# EAGLE design CM_Nightfall-Air_v1 (EAGLE 9.6.2)
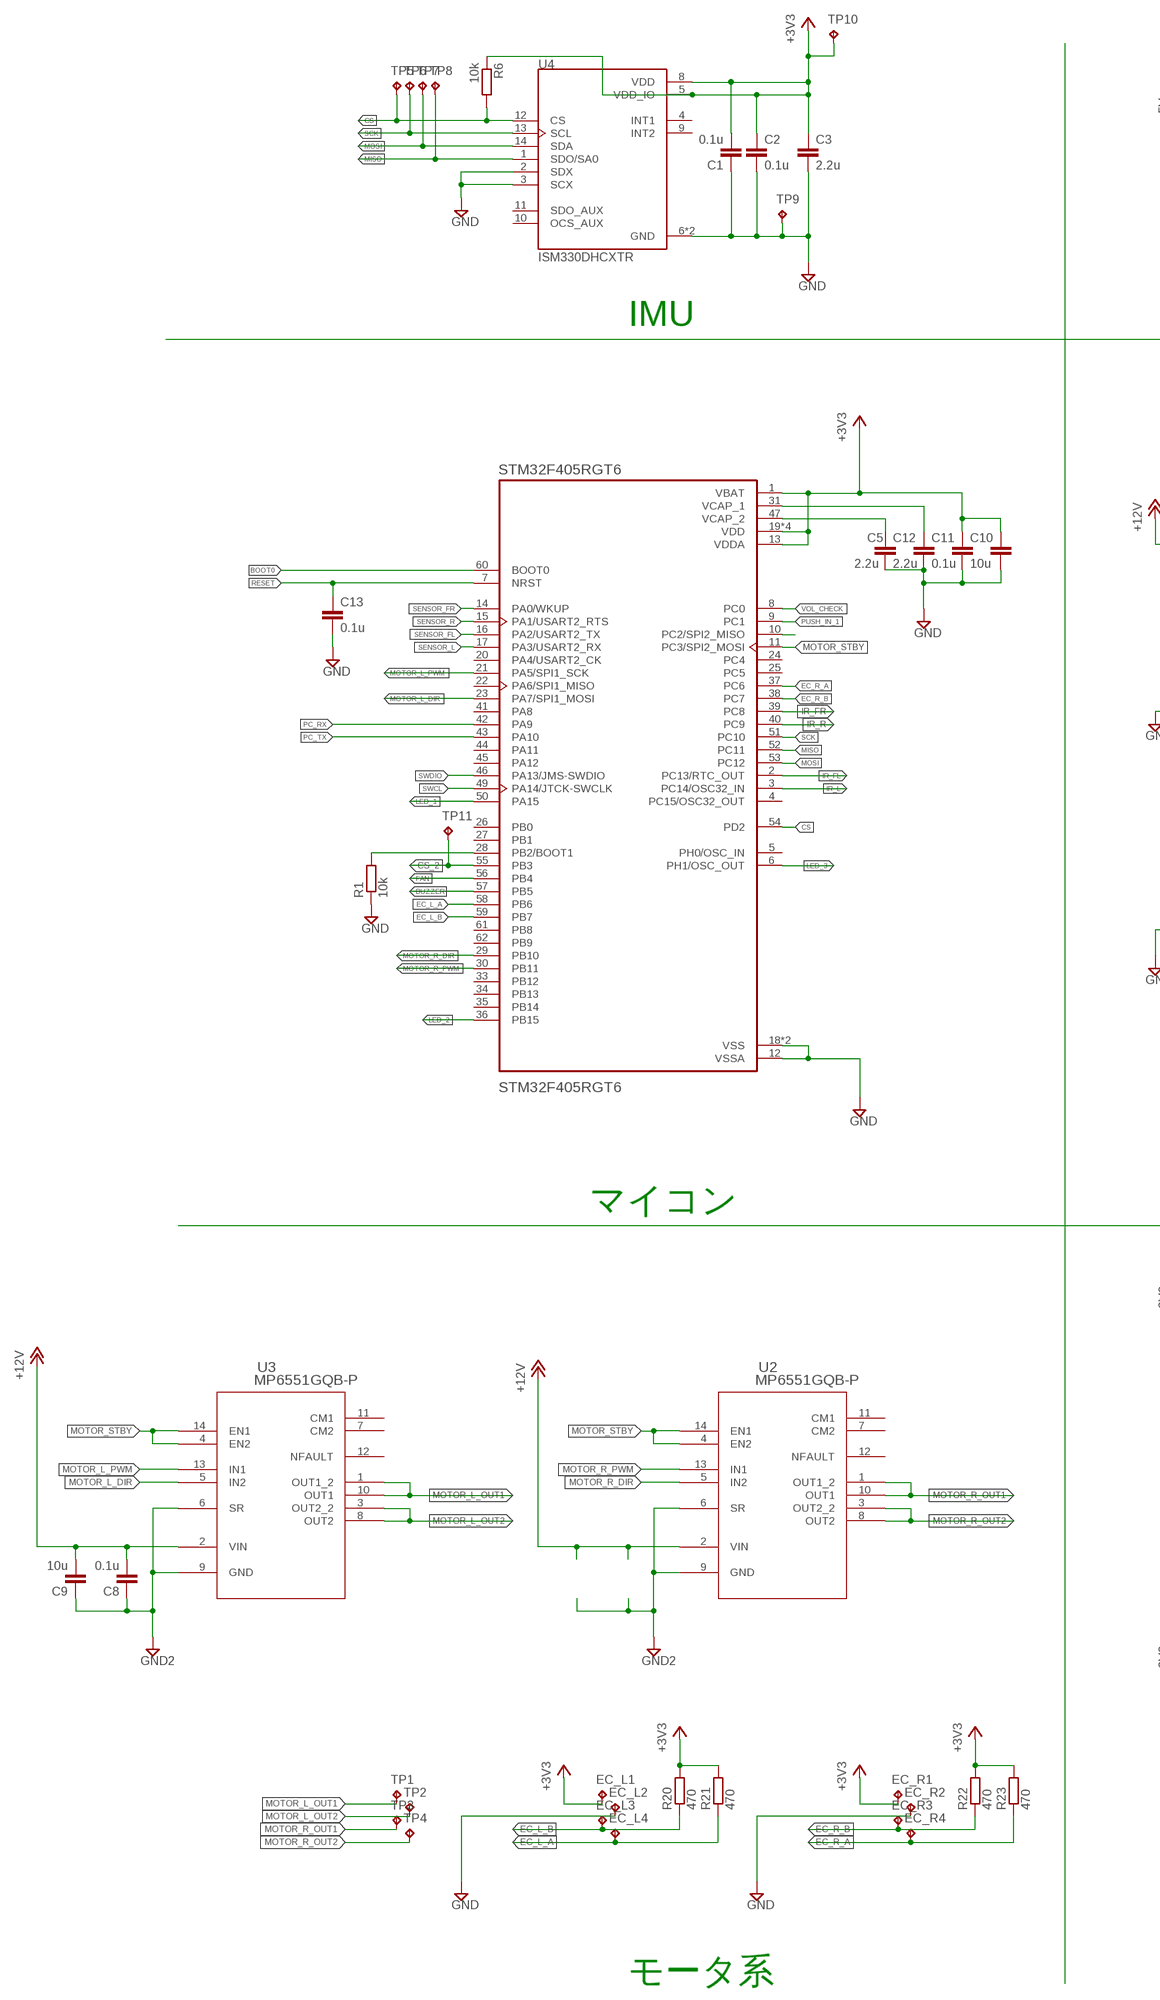
[diagram p0: schematic, sheet 1, part 1 of 2]
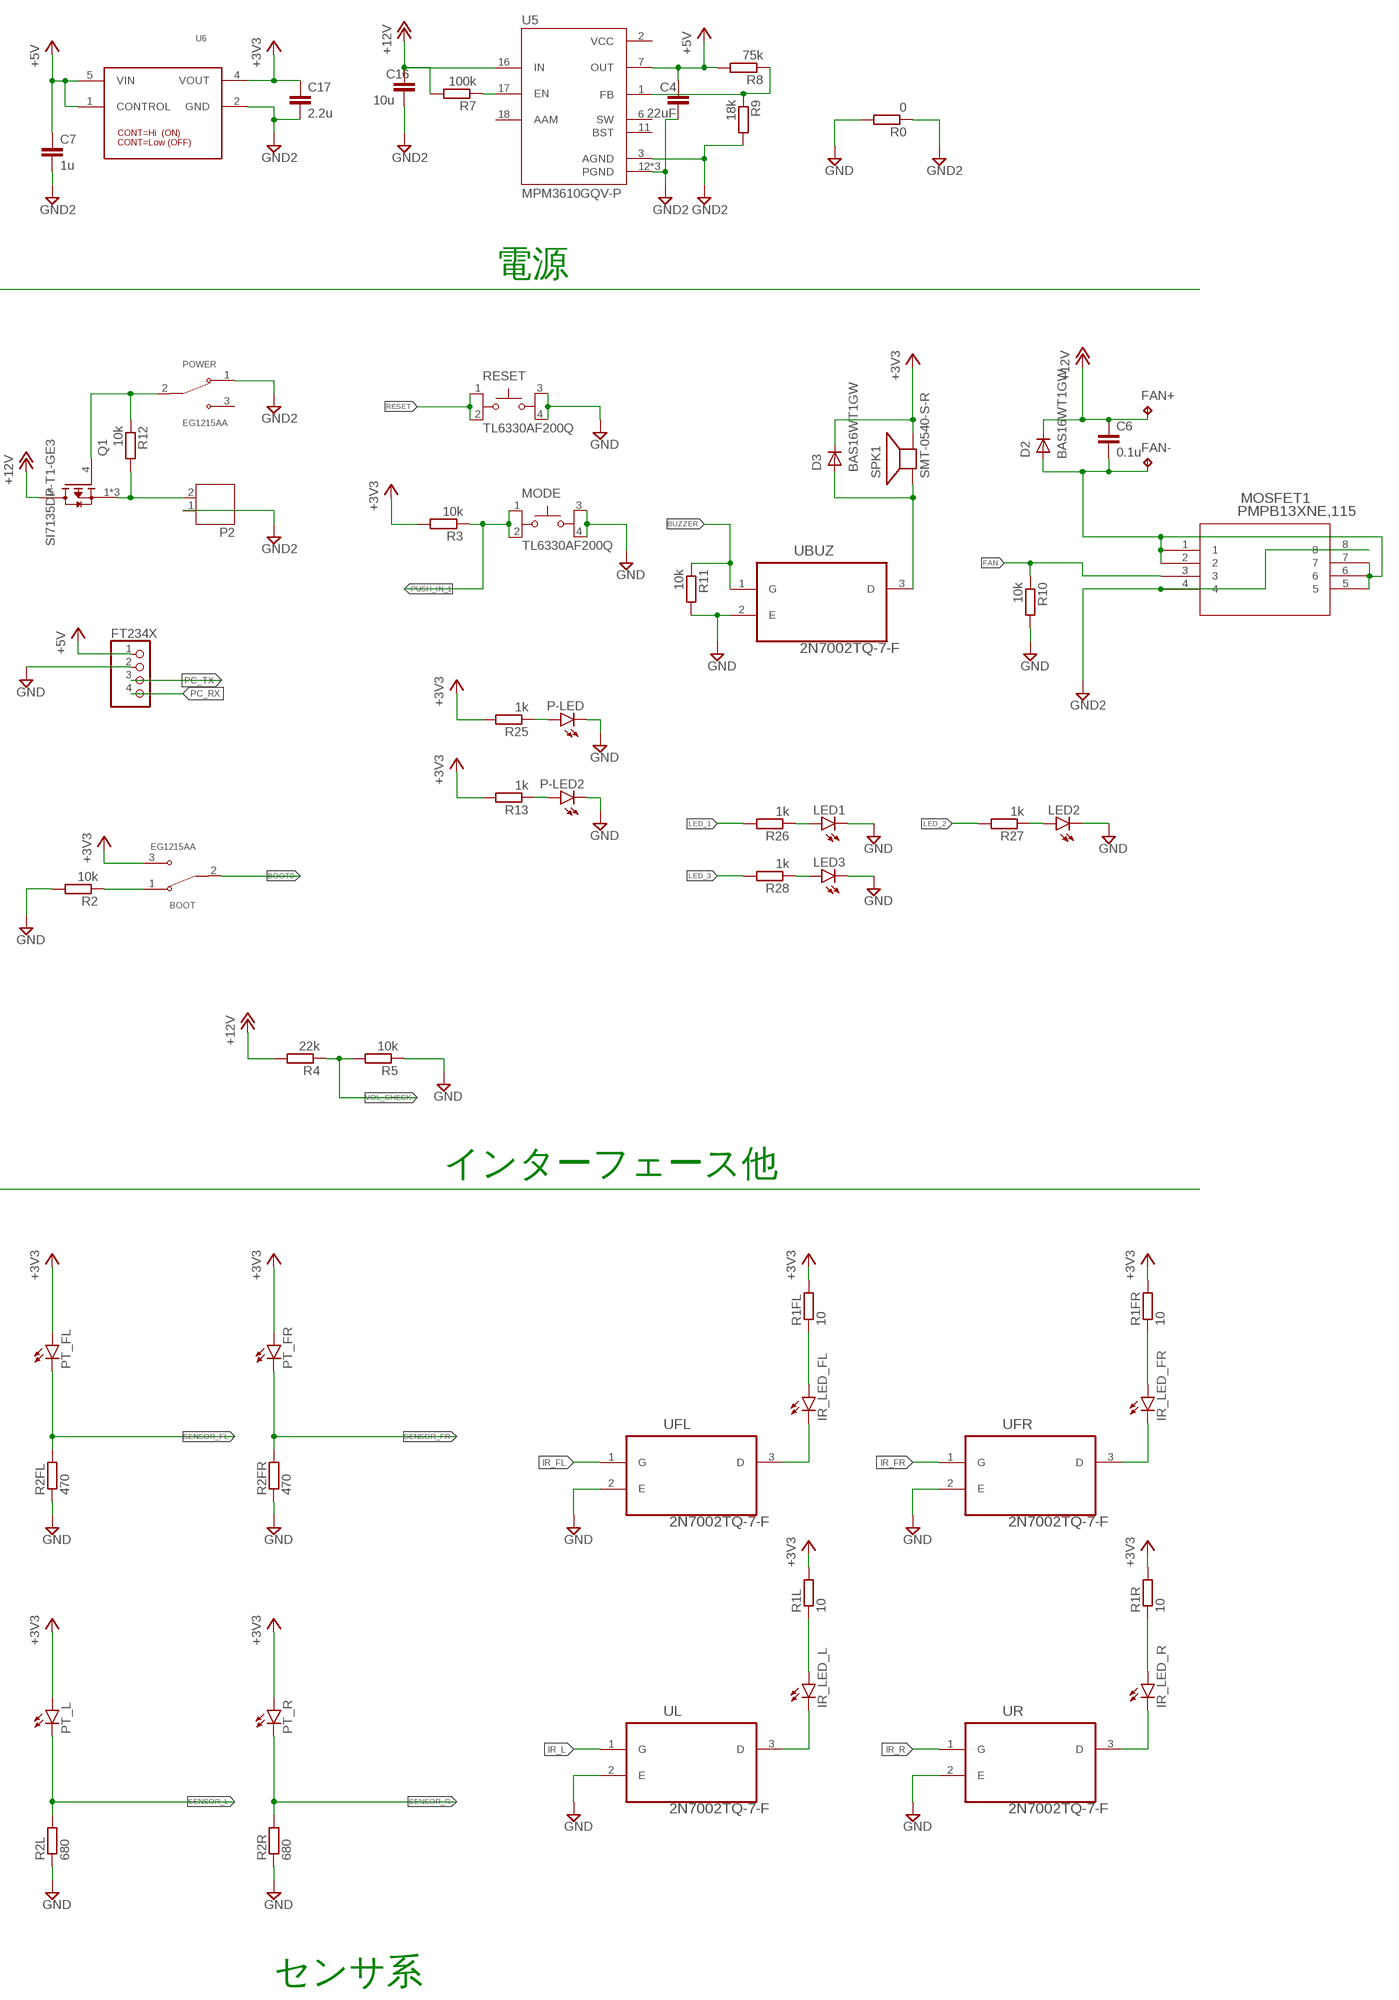
[diagram p1: schematic, sheet 1, part 2 of 2]

## Parts
BOOT  EG1215AA  [SW_EG1215AA]
C1  0.1u  C-EUC0402  [C0402]
C2  0.1u  C-EUC0402  [C0402]
C3  2.2u  C-EUC0402  [C0402]
C4  22uF  C-EUC0402  [C0402]
C5  2.2u  C-EUC0402  [C0402]
C6  0.1u  C-EUC0402  [C0402]
C7  1u  C-EUC0402  [C0402]
C8  0.1u  C-EUC0402  [C0402]
C9  10u  C-EUC0402  [C0402]
C10  10u  C-EUC0402  [C0402]
C11  0.1u  C-EUC0402  [C0402]
C12  2.2u  C-EUC0402  [C0402]
C13  0.1u  C-EUC0402  [C0402]
C16  10u  C-EUC0402  [C0402]
C17  2.2u  C-EUC0402  [C0402]
D2  BAS16WT1GW  [SOT323]
D3  BAS16WT1GW  [SOT323]
EC_L1  TPB1,27  [B1,27]
EC_L2  TPB1,27  [B1,27]
EC_L3  TPB1,27  [B1,27]
EC_L4  TPB1,27  [B1,27]
EC_R1  TPB1,27  [B1,27]
EC_R2  TPB1,27  [B1,27]
EC_R3  TPB1,27  [B1,27]
EC_R4  TPB1,27  [B1,27]
FAN+  TPB1,27  [B1,27]
FAN-  TPB1,27  [B1,27]
FT234X  PINHD-1X4  [1X04]
IR_LED_FL  LED5MM  [LED5MM]
IR_LED_FR  LED5MM  [LED5MM]
IR_LED_L  LED5MM  [LED5MM]
IR_LED_R  LED5MM  [LED5MM]
LED1  LEDCHIPLED_0603  [CHIPLED_0603]
LED2  LEDCHIPLED_0603  [CHIPLED_0603]
LED3  LEDCHIPLED_0603  [CHIPLED_0603]
MODE  TL6330AF200Q  [SW_TL6330AF200Q]
MOSFET1  PMPB13XNE,115  [DFN2020MD-6_SOT1220_NEX]
P2  JST-PH2  [JST-PH2]
P-LED  LEDCHIPLED_0603  [CHIPLED_0603]
P-LED2  LEDCHIPLED_0603  [CHIPLED_0603]
POWER  EG1215AA  [SW_EG1215AA]
PT_FL  LED5MM  [LED5MM]
PT_FR  LED5MM  [LED5MM]
PT_L  LED5MM  [LED5MM]
PT_R  LED5MM  [LED5MM]
Q1  SI7135DP-T1-GE3  [TRANS_SI7135DP-T1-GE3]
R0  0  R-EU_R0402  [R0402]
R1  10k  R-EU_R0402  [R0402]
R1FL  10  R-EU_R0402  [R0402]
R1FR  10  R-EU_R0402  [R0402]
R1L  10  R-EU_R0402  [R0402]
R1R  10  R-EU_R0402  [R0402]
R2  10k  R-EU_R0402  [R0402]
R2FL  470  R-EU_R0402  [R0402]
R2FR  470  R-EU_R0402  [R0402]
R2L  680  R-EU_R0402  [R0402]
R2R  680  R-EU_R0402  [R0402]
R3  10k  R-EU_R0402  [R0402]
R4  22k  R-EU_R0402  [R0402]
R5  10k  R-EU_R0402  [R0402]
R6  10k  R-EU_R0402  [R0402]
R7  100k  R-EU_R0402  [R0402]
R8  75k  R-EU_R0402  [R0402]
R9  18k  R-EU_R0402  [R0402]
R10  10k  R-EU_R0402  [R0402]
R11  10k  R-EU_R0402  [R0402]
R12  10k  R-EU_R0402  [R0402]
R13  1k  R-EU_R0402  [R0402]
R20  470  R-EU_R0402  [R0402]
R21  470  R-EU_R0402  [R0402]
R22  470  R-EU_R0402  [R0402]
R23  470  R-EU_R0402  [R0402]
R25  1k  R-EU_R0402  [R0402]
R26  1k  R-EU_R0402  [R0402]
R27  1k  R-EU_R0402  [R0402]
R28  1k  R-EU_R0402  [R0402]
RESET  TL6330AF200Q  [SW_TL6330AF200Q]
SPK1  SMT-0540-S-R  [SMT-0540-S-R]
STM32F405RGT6  STM32F405RGT6  [QFP50P1200X1200X160-64N]
TP1  TPB1,27  [B1,27]
TP2  TPB1,27  [B1,27]
TP3  TPB1,27  [B1,27]
TP4  TPB1,27  [B1,27]
TP5  TPTP06R  [TP06R]
TP6  TPTP06R  [TP06R]
TP7  TPTP06R  [TP06R]
TP8  TPTP06R  [TP06R]
TP9  TPTP06R  [TP06R]
TP10  TPTP06R  [TP06R]
TP11  TPTP06R  [TP06R]
U2  MP6551GQB-P  [QFN-14_MP6551_MNP]
U3  MP6551GQB-P  [QFN-14_MP6551_MNP]
U4  ISM330DHCXTR  [PQFN50P250X300X86-14N]
U5  MPM3610GQV-P  [CONV_MPM3610GQV-P]
U6  I-10673_NJM2884U1-33  [NJM2884U1-33]
UBUZ  2N7002TQ-7-F  [SOT50P160X90-3N]
UFL  2N7002TQ-7-F  [SOT50P160X90-3N]
UFR  2N7002TQ-7-F  [SOT50P160X90-3N]
UL  2N7002TQ-7-F  [SOT50P160X90-3N]
UR  2N7002TQ-7-F  [SOT50P160X90-3N]

## Nets
+3V3 [power]: BOOT.3 C1.2 C2.1 C3.1 C10.1 C11.1 C17.1 D3.3(K) EC_L1.TP EC_R1.TP PT_FL.A PT_FR.A PT_L.A PT_R.A R1FL.2 R1FR.2 R1L.2 R1R.2 R3.2 R6.1 R13.2 R20.2 R21.2 R22.2 R23.2 R25.2 SPK1.+(-) STM32F405RGT6.1(VBAT) STM32F405RGT6.13(VDDA) STM32F405RGT6.19(VDD) STM32F405RGT6.32(VDD) STM32F405RGT6.48(VDD) STM32F405RGT6.64(VDD) TP10.TP U4.5(VDD_IO) U4.8(VDD) U6.4(VOUT)
+5V [power]: C4.1 C7.1 FT234X.1 R8.2 U5.7(OUT) U6.1(CONTROL) U6.5(VIN)
+12V: C6.1 C8.2 C9.2 C16.1 D2.3(K) FAN+.TP Q1.5(D) R4.2 R7.2 U2.2(VIN) U3.2(VIN) U5.16(IN)
BOOT0: BOOT.2 STM32F405RGT6.60(BOOT0)
BUZZER: R11.1 STM32F405RGT6.57(PB5) UBUZ.1(G)
CS: R6.2 STM32F405RGT6.54(PD2) TP5.TP U4.12(CS)
CS_2: STM32F405RGT6.55(PB3) TP11.TP
EC_L_A: EC_L4.TP R21.1 STM32F405RGT6.58(PB6)
EC_L_B: EC_L3.TP R20.1 STM32F405RGT6.59(PB7)
EC_R_A: EC_R4.TP R23.1 STM32F405RGT6.37(PC6)
EC_R_B: EC_R3.TP R22.1 STM32F405RGT6.38(PC7)
FAN: MOSFET1.3 R10.1 STM32F405RGT6.56(PB4)
GND [motor]: C1.1 C2.2 C3.2 C5.2 C10.2 C11.2 C12.2 C13.2 EC_L2.TP EC_R2.TP FT234X.2 LED1.C LED2.C LED3.C MODE.3 MODE.4 P-LED2.C P-LED.C R0.2 R1.1 R2.2 R2FL.1 R2FR.1 R2L.1 R2R.1 R5.1 R10.2 R11.2 RESET.3 RESET.4 STM32F405RGT6.12(VSSA) STM32F405RGT6.18(VSS) STM32F405RGT6.63(VSS) TP9.TP U4.2(SDX) U4.3(SCX) U4.6(GND) U4.7(GND) UBUZ.2(E) UFL.2(E) UFR.2(E) UL.2(E) UR.2(E)
GND2 [motor]: C4.2 C7.2 C8.1 C9.1 C16.2 C17.2 MOSFET1.4 MOSFET1.8 P2.1 POWER.1 R0.1 R9.2 U2.6(SR) U2.9(GND) U3.6(SR) U3.9(GND) U5.3(AGND) U5.12(PGND) U5.13(PGND) U5.14(PGND) U6.2(GND)
IR_FL: STM32F405RGT6.2(PC13/RTC_OUT) UFL.1(G)
IR_FR: STM32F405RGT6.39(PC8) UFR.1(G)
IR_L: STM32F405RGT6.3(PC14/OSC32_IN) UL.1(G)
IR_R: STM32F405RGT6.40(PC9) UR.1(G)
LED_1: R26.2 STM32F405RGT6.50(PA15)
LED_2: R27.2 STM32F405RGT6.36(PB15)
LED_3: R28.2 STM32F405RGT6.6(PH1/OSC_OUT)
MISO: STM32F405RGT6.52(PC11) TP8.TP U4.1(SDO/SA0)
MOSI: STM32F405RGT6.53(PC12) TP7.TP U4.14(SDA)
MOTOR_L_DIR: STM32F405RGT6.23(PA7/SPI1_MOSI) U3.5(IN2)
MOTOR_L_OUT1 [motor]: TP1.TP U3.1(OUT1_2) U3.10(OUT1)
MOTOR_L_OUT2 [motor]: TP2.TP U3.3(OUT2_2) U3.8(OUT2)
MOTOR_L_PWM: STM32F405RGT6.21(PA5/SPI1_SCK) U3.13(IN1)
MOTOR_R_DIR: STM32F405RGT6.29(PB10) U2.5(IN2)
MOTOR_R_OUT1 [motor]: TP3.TP U2.1(OUT1_2) U2.10(OUT1)
MOTOR_R_OUT2 [motor]: TP4.TP U2.3(OUT2_2) U2.8(OUT2)
MOTOR_R_PWM: STM32F405RGT6.30(PB11) U2.13(IN1)
MOTOR_STBY: STM32F405RGT6.11(PC3/SPI2_MOSI) U2.4(EN2) U2.14(EN1) U3.4(EN2) U3.14(EN1)
N$1: P2.2 Q1.1(S) Q1.2(S) Q1.3(S) R12.2
N$2: IR_LED_FL.K(C) UFL.3(D)
N$4: R7.1 U5.17(EN)
N$5: P-LED2.A R13.1
N$7: R8.1 R9.1 U5.1(FB)
N$8: IR_LED_FL.A R1FL.1
N$10: IR_LED_L.K(C) UL.3(D)
N$11: POWER.2 Q1.4(G) R12.1
N$13: C5.1 STM32F405RGT6.47(VCAP_2)
N$14: C12.1 STM32F405RGT6.31(VCAP_1)
N$15 [motor]: R1.2 STM32F405RGT6.28(PB2/BOOT1)
N$16: IR_LED_L.A R1L.1
N$18: IR_LED_FR.K(C) UFR.3(D)
N$19: BOOT.1 R2.1
N$20: C6.2 D2.1(A) FAN-.TP MOSFET1.1 MOSFET1.2 MOSFET1.5 MOSFET1.6 MOSFET1.7
N$21: P-LED.A R25.1
N$23: D3.1(A) SPK1.-(+) UBUZ.3(D)
N$27: LED1.A R26.1
N$28: IR_LED_FR.A R1FR.1
N$29: IR_LED_R.K(C) UR.3(D)
N$30: IR_LED_R.A R1R.1
N$36: LED2.A R27.1
N$41: LED3.A R28.1
PC_RX: FT234X.4 STM32F405RGT6.42(PA9)
PC_TX: FT234X.3 STM32F405RGT6.43(PA10)
PUSH_IN_1: MODE.1 MODE.2 R3.1 STM32F405RGT6.9(PC1)
PUSH_IN_2: STM32F405RGT6.10(PC2/SPI2_MISO)
RESET: C13.1 RESET.1 RESET.2 STM32F405RGT6.7(NRST)
SCK: STM32F405RGT6.51(PC10) TP6.TP U4.13(SCL)
SENSOR_FL: PT_FL.K(C) R2FL.2 STM32F405RGT6.16(PA2/USART2_TX)
SENSOR_FR: PT_FR.K(C) R2FR.2 STM32F405RGT6.14(PA0/WKUP)
SENSOR_L: PT_L.K(C) R2L.2 STM32F405RGT6.17(PA3/USART2_RX)
SENSOR_R: PT_R.K(C) R2R.2 STM32F405RGT6.15(PA1/USART2_RTS)
SWCL: STM32F405RGT6.49(PA14/JTCK-SWCLK)
SWDIO: STM32F405RGT6.46(PA13/JMS-SWDIO)
VOL_CHECK: R4.1 R5.2 STM32F405RGT6.8(PC0)
Unconnected: POWER.3 STM32F405RGT6.4(PC15/OSC32_OUT) STM32F405RGT6.5(PH0/OSC_IN) STM32F405RGT6.20(PA4/USART2_CK) STM32F405RGT6.22(PA6/SPI1_MISO) STM32F405RGT6.24(PC4) STM32F405RGT6.25(PC5) STM32F405RGT6.26(PB0) STM32F405RGT6.27(PB1) STM32F405RGT6.33(PB12) STM32F405RGT6.34(PB13) STM32F405RGT6.35(PB14) STM32F405RGT6.41(PA8) STM32F405RGT6.44(PA11) STM32F405RGT6.45(PA12) STM32F405RGT6.61(PB8) STM32F405RGT6.62(PB9) U2.7(CM2) U2.11(CM1) U2.12(NFAULT) U3.7(CM2) U3.11(CM1) U3.12(NFAULT) U4.4(INT1) U4.9(INT2) U4.10(OCS_AUX) U4.11(SDO_AUX) U5.6(SW) U5.11(BST) U5.18(AAM)

## Notes on the sheet
- IMU | 電源
- マイコン | インターフェース他
- モータ系
- センサ系

## Power pins joined to a net without a drawn wire
VCC: U5.2(VCC)

## Library data of the parts
BOOT POWER = EG1215AA:EG1215AA: Slide Switch SPDT Surface Mount, Right Angle Check availability <https://pricing.snapeda.com/parts/EG1215AA/E-Switch/view-part?ref=eda>; AVAILABILITY: In Stock; CHECK_PRICES: https://www.snapeda.com/parts/EG1215AA/E-Switch/view-part/?ref=eda; DESCRIPTION: Slide Switch SPDT Surface Mount, Right Angle; MF: E-Switch; MP: EG1215AA; PACKAGE: None; PRICE: None; PURCHASE-URL: https://www.snapeda.com/api/url_track_click_mouser/?unipart_id=3210616&manufacturer=E-Switch&part_name=EG1215AA&search_term=eg1215aa; SNAPEDA_LINK: https://www.snapeda.com/parts/EG1215AA/E-Switch/view-part/?ref=snap
C1-C13 C16 C17 = rcl:C-EU: CAPACITOR, European symbol; SPICEPREFIX: C
D2 D3 = BAS16WT1G:BAS16WT1G: Check availability <https://pricing.snapeda.com/parts/BAS16WT1G/ON%20Semiconductor/view-part?ref=eda>; AVAILABILITY: In Stock; CHECK_PRICES: https://www.snapeda.com/parts/BAS16WT1G/Onsemi/view-part/?ref=eda; DESCRIPTION: DIODE, SIGNAL, 75V, SC70; Diode Type:Small Signal; Voltage, Vrrm:75V; Time, trr Typ:6ns; Voltage, Vf Max:1.25V; Temperature, Tj Max:150°C; Termination Type:SMD; Operating Temperature Range:-55°C to +150°C; Case Style:SC-70; No. of Pins:3; Voltage, Breakdown Max:75V; MF: ON Semiconductor; MP: BAS16WT1G; PACKAGE: SC-70-3 ON Semiconductor; PRICE: None; SNAPEDA_LINK: https://www.snapeda.com/parts/BAS16WT1G/Onsemi/view-part/?ref=snap
EC_L1-EC_L4 EC_R1-EC_R4 FAN+ FAN- TP1-TP11 = testpad:TP: Test pad
FT234X = pinhead:PINHD-1X4: PIN HEADER
IR_LED_FL IR_LED_FR IR_LED_L IR_LED_R LED1-LED3 P-LED P-LED2 PT_FL PT_FR PT_L PT_R = led:LED: LED OSRAM: - CHIPLED LG R971, LG N971, LY N971, LG Q971, LY Q971, LO R971, LY R971 LH N974, LH R974 LS Q976, LO Q976, LY Q976 LO Q996 - Hyper CHIPLED LW Q18S LB Q993, LB Q99A, LB R99A - SideLED LS A670, LO A670, LY A670, LG A670, LP A670 LB A673, LV A673, LT A673, LW A673 LH A674 LY A675 LS A676, LA A676, LO A676, LY A676, LW A676 LS A679, LY A679, LG A679 - Hyper Micro SIDELED® LS Y876, LA Y876, LO Y876, LY Y876 LT Y87S - SmartLED LW L88C, LW L88S LB L89C, LB L89S, LG L890 LS L89K, LO L89K, LY L89K LS L896, LA L896, LO L896, LY L896 - TOPLED LS T670, LO T670, LY T670, LG T670, LP T670 LSG T670, LSP T670, LSY T670, LOP T670, LYG T670 LG T671, LOG T671, LSG T671 LB T673, LV T673, LT T673, LW T673 LH T674 LS T676, LA T676, LO T676, LY T676, LB T676, LH T676, LSB T676, LW T676 LB T67C, LV T67C, LT T67C, LS T67K, LO T67K, LY T67K, LW E67C LS E67B, LA E67B, LO E67B, LY E67B, LB E67C, LV E67C, LT E67C LW T67C LS T679, LY T679, LG T679 LS T770, LO T770, LY T770, LG T770, LP T770 LB T773, LV T773, LT T773, LW T773 LH T774 LS E675, LA E675, LY E675, LS T675 LS T776, LA T776, LO T776, LY T776, LB T776 LHGB T686 LT T68C, LB T68C - Hyper Mini TOPLED® LB M676 - Mini TOPLED Santana® LG M470 LS M47K, LO M47K, LY M47K Source: http://www.osram.convergy.de LUXEON: - LUMILED® LXK2-PW12-R00, LXK2-PW12-S00, LXK2-PW14-U00, LXK2-PW14-V00 LXK2-PM12-R00, LXK2-PM12-S00, LXK2-PM14-U00 LXK2-PE12-Q00, LXK2-PE12-R00, LXK2-PE12-S00, LXK2-PE14-T00, LXK2-PE14-U00 LXK2-PB12-K00, LXK2-PB12-L00, LXK2-PB12-M00, LXK2-PB14-N00, LXK2-PB14-P00, LXK2-PB14-Q00 LXK2-PR12-L00, LXK2-PR12-M00, LXK2-PR14-Q00, LXK2-PR14-R00 LXK2-PD12-Q00, LXK2-PD12-R00, LXK2-PD12-S00 LXK2-PH12-R00, LXK2-PH12-S00 LXK2-PL12-P00, LXK2-PL12-Q00, LXK2-PL12-R00 Source: www.luxeon.com KINGBRIGHT: KA-3528ASYC Source: www.kingbright.com
MODE RESET = TL6330AF200Q:TL6330AF200Q: Check availability <https://pricing.snapeda.com/parts/TL6330AF200Q/E-Switch/view-part?ref=eda>; AVAILABILITY: In Stock; CHECK_PRICES: https://www.snapeda.com/parts/TL6330AF200Q/E-Switch/view-part/?ref=eda; DESCRIPTION: Tactile Switch SPST-NO Top Actuated Surface Mount; MF: E-Switch; MP: TL6330AF200Q; PACKAGE: None; PRICE: None; PURCHASE-URL: https://www.snapeda.com/api/url_track_click_mouser/?unipart_id=2720563&manufacturer=E-Switch&part_name=TL6330AF200Q&search_term=tl6330af200q; SNAPEDA_LINK: https://www.snapeda.com/parts/TL6330AF200Q/E-Switch/view-part/?ref=snap
MOSFET1 = PMPB13XNE,115:PMPB13XNE,115; COPYRIGHT: Copyright (C) 2025 Ultra Librarian. All rights reserved.; MANUFACTURER_NAME: Nexperia; MANUFACTURER_PART_NUMBER: PMPB13XNE,115
P2 = jst-ph:JST-PH2
Q1 = SI7135DP-T1-GE3:SI7135DP-T1-GE3; MANUFACTURER: Vishay Siliconix; MAXIMUM_PACKAGE_HEIGHT: 1.12mm; PARTREV: A; STANDARD: Manufacturer Recommendations
R0 R1 R1FL R1FR R1L R1R R2 R2FL R2FR R2L R2R R3-R13 R20-R23 R25-R28 = rcl:R-EU_: RESISTOR, European symbol; SPICEPREFIX: R
SPK1 = SMT-0540-S-R:SMT-0540-S-R: SMT-0549-S-R Small surface-mount magnetic buzzer; DESCRIPTION: Buzzers Transducer, Externally Driven Electromechanical/Magnetic 3V 100mA 4kHz 78dB @ 3V, 10cm Surface Mount Solder Pads; DIGI-KEY_PART_NUMBER: 668-1060-1-ND; MF: PUI; MP: SMT-0540-S-R; PACKAGE: PUI; PURCHASE-URL: https://pricing.snapeda.com/search/part/SMT-0540-S-R/?ref=eda
STM32F405RGT6 = stm32_f405rgt6:STM32F405RGT6: High-performance foundation line, ARM Cortex-M4 core with DSP and FPU, 1 Mbyte Flash, 168 MHz CPU, ART Accelerator; AVAILABILITY: Unavailable; DESCRIPTION: ARM® Cortex®-M4 STM32F4 Microcontroller IC 32-Bit 168MHz 1MB (1M x 8) FLASH 64-LQFP (10x10); MF: STMicroelectronics; MP: STM32F405RGT6; PACKAGE: LQFP-64 STMicroelectronics; PRICE: None
U2 U3 = MP6551:MP6551GQB-P; COPYRIGHT: Copyright (C) 2025 Ultra Librarian. All rights reserved.; MANUFACTURER_PART_NUMBER: MP6551GQB-P; MFR_NAME: Monolithic Power Systems
U4 = ISM330DHCXTR:ISM330DHCXTR: Check availability <https://pricing.snapeda.com/parts/ISM330DHCXTR/STMicroelectronics/view-part?ref=eda>; AVAILABILITY: In Stock; CHECK_PRICES: https://www.snapeda.com/parts/ISM330DHCXTR/STMicroelectronics/view-part/?ref=eda; DESCRIPTION: Accelerometer, Gyroscope, Temperature, 6 Axis Sensor I2C, SPI Output; MF: STMicroelectronics; MP: ISM330DHCXTR; PACKAGE: VFLGA-14 STMicroelectronics; PRICE: None; SNAPEDA_LINK: https://www.snapeda.com/parts/ISM330DHCXTR/STMicroelectronics/view-part/?ref=snap
U5 = MPM3610GQV-P:MPM3610GQV-P: Check availability <https://pricing.snapeda.com/parts/MPM3610GQVP/Monolithic%20Power%20Systems/view-part?ref=eda>; AVAILABILITY: In Stock; CHECK_PRICES: https://www.snapeda.com/parts/MPM3610GQVP/Monolithic+Power+Systems/view-part/?ref=eda; DESCRIPTION: Non-Isolated PoL Module DC DC Converter 1 Output 0.8 ~ 18.48V - - 1.2A 4.5V - 21V Input; MF: Monolithic Power Systems; MP: MPM3610GQVP; PACKAGE: QFN-20 MPS; PRICE: None; SNAPEDA_LINK: https://www.snapeda.com/parts/MPM3610GQVP/Monolithic+Power+Systems/view-part/?ref=snap
U6 = Akizuki:I-10673_NJM2884U1-33
UBUZ UFL UFR UL UR = 2N7002TQ-7-F:2N7002TQ-7-F: Check availability <https://pricing.snapeda.com/parts/2N7002TQ-7-F/Diodes%20Inc./view-part?ref=eda>; AVAILABILITY: In Stock; CHECK_PRICES: https://www.snapeda.com/parts/2N7002TQ-7-F/Diodes+Inc./view-part/?ref=eda; DESCRIPTION: N-Channel 60 V 115mA (Ta) 150mW (Ta) Surface Mount SOT-523; MF: Diodes Inc.; MP: 2N7002TQ-7-F; PACKAGE: SOT-523 Diodes Inc.; PRICE: None; SNAPEDA_LINK: https://www.snapeda.com/parts/2N7002TQ-7-F/Diodes+Inc./view-part/?ref=snap

## Net classes
1 power: width 0.152 mm
2 motor: width 0.152 mm

## Board
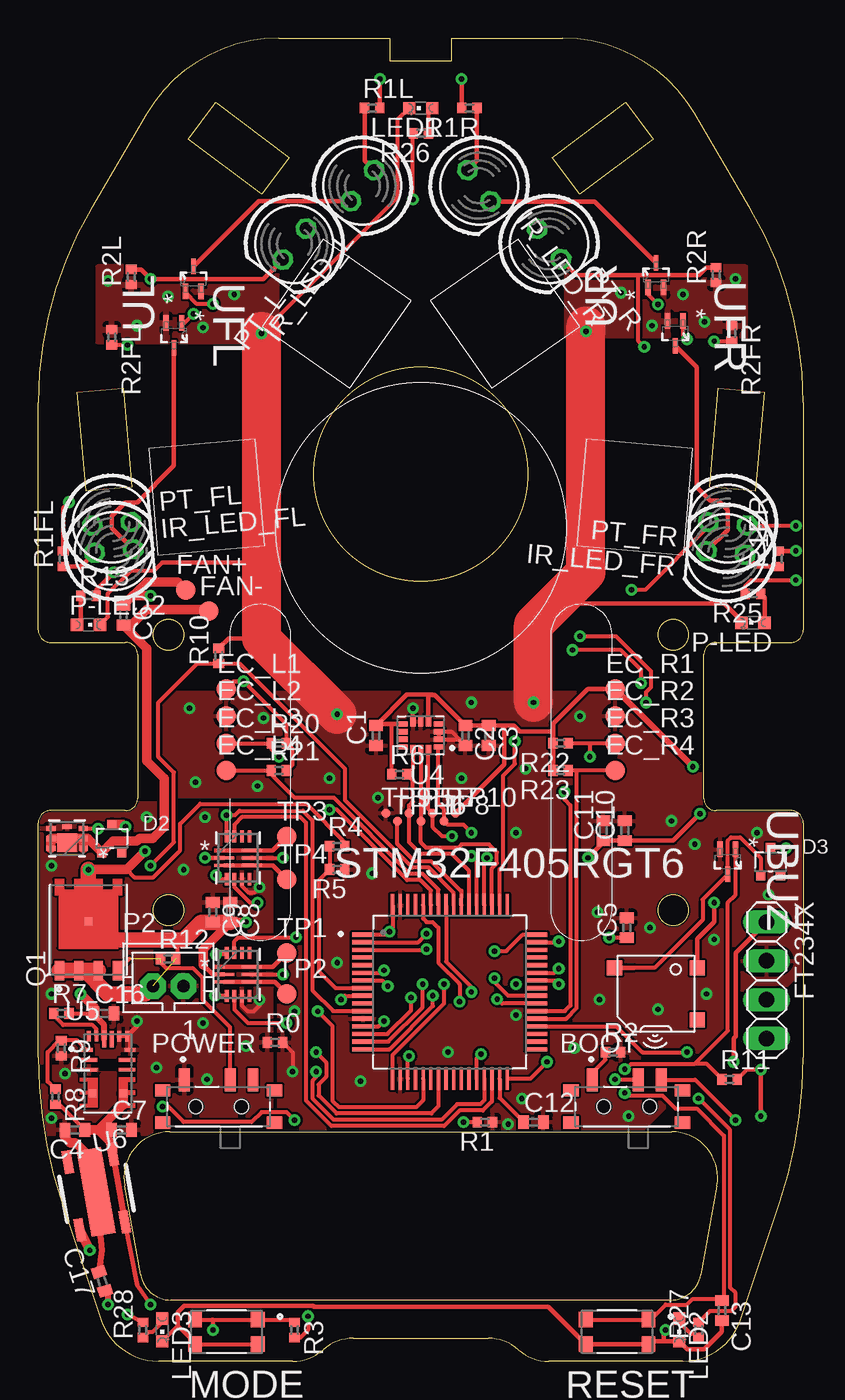
[diagram p2: board, top side]
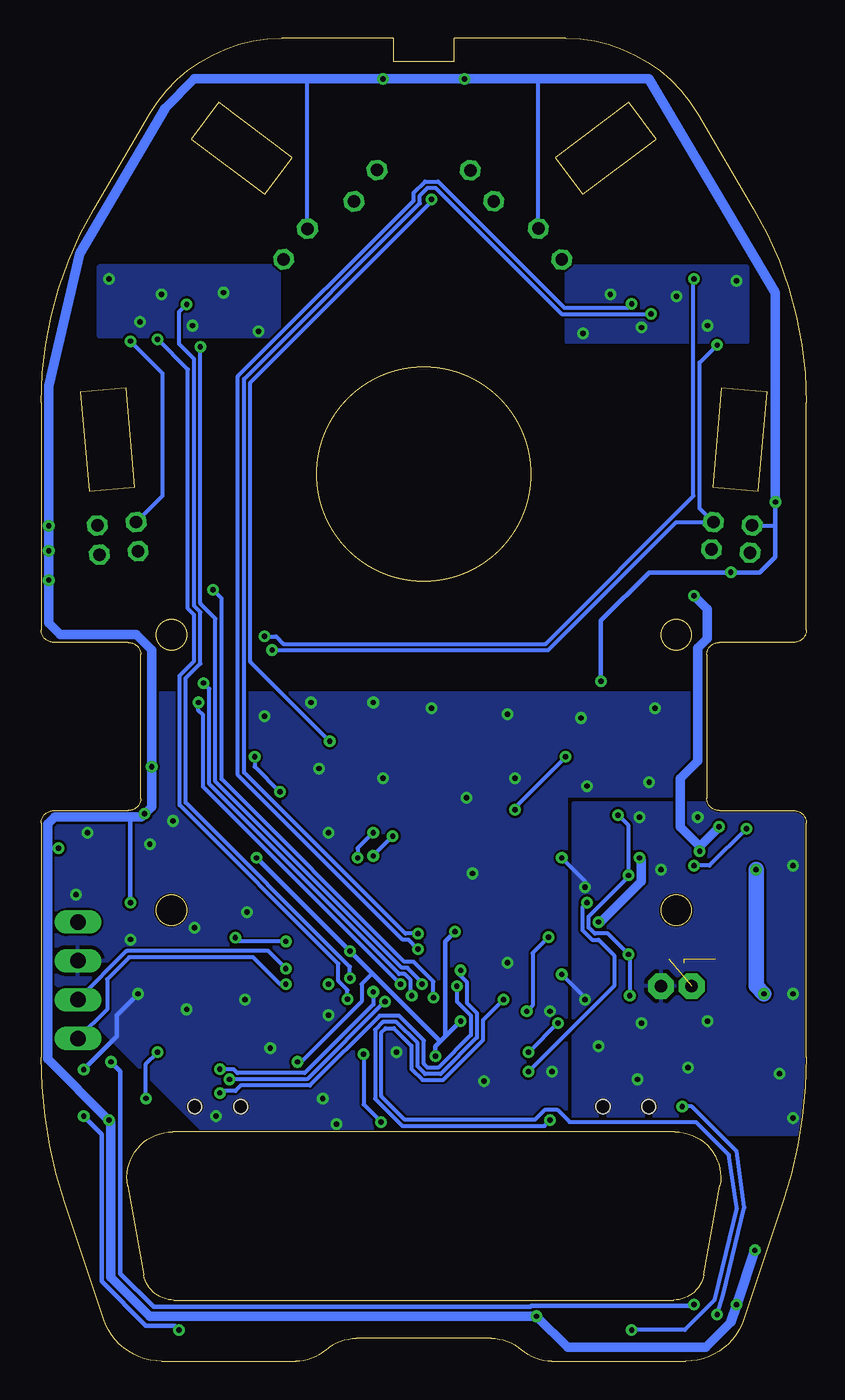
[diagram p3: board, bottom side, seen from below]

Size 50 x 86.5 mm. Coordinates in mm from the lower left corner, seen from the top.
Outline: 41.33,4 8.67,4 arc-80 6.7,5.64 5.64,11.46 arc-100 8.6,15 41.41,15 arc-100 44.36,11.46 43.3,5.64 arc-80 41.33,4
Outline: 33.6,78.7 38.39,82.31 40.2,79.91 35.4,76.3 33.6,78.7
Outline: 14.6,76.3 9.81,79.91 11.61,82.31 16.4,78.7 14.6,76.3
Outline: 2.56,63.35 5.55,63.62 6.11,57.14 3.12,56.88 2.56,63.35
Outline: 43.89,57.14 44.45,63.62 47.44,63.35 46.88,56.88 43.89,57.14
Outline: 27,86.5 34.28,86.5 arc-60 42.9,81.57 46.55,75.37 arc-30 50,62.69 50,47.8 arc-90 49.2,47 44.3,47 arc90 43.5,46.2 43.5,36.8 arc90 44.3,36 49.2,36 arc-90 50,35.2 50,19.87 arc-18 48.46,10.38 45.91,2.73 arc-72 42.12,0 33.37,0 arc-41 31.39,0.75 arc41 29.4,1.5 20.6,1.5 arc41 18.61,0.75 arc-41 16.63,0 7.88,0 arc-72 4.09,2.73 1.54,10.38 arc-18 0,19.87 0,35.2 arc-90 0.8,36 5.7,36 arc90 6.5,36.8 6.5,46.2 arc90 5.7,47 0.8,47 arc-90 0,47.8 0,62.69 arc-30 3.45,75.37 7.1,81.57 arc-60 15.72,86.5 23,86.5 23,85 27,85 27,86.5
Outline: circle at 25,58 radius 7
Outline: circle at 41.5,47.5 radius 1
Outline: circle at 41.5,29.5 radius 1
Outline: circle at 8.5,29.5 radius 1
Outline: circle at 8.5,47.5 radius 1
Copper layers (1*16): Top 0.035mm / dielectric 1.5mm / Bottom 0.035mm
Design rules "default *": minimum track width 6mil, minimum drill 0.2mm, track to track 6mil, track to pad 6mil, pad to pad 6mil, via to via 6mil, smd to smd 6mil, copper to edge 0.1mm, drill to drill 0.15mm, minimum pad ring 10mil, minimum via ring 8mil, stop-mask expansion 4mil, vias tented up to drill 100mil, thermal gap 10mil

### Footprints (pad centres in the part's own frame; a part is rotated, then mirrored left to right if it is on the bottom)
SW_EG1215AA = smd 0.7 x 1.5: 1 -2.25,1.75; 2 0.75,1.75; 3 2.25,1.75 | smd 1 x 0.8: S1 -3.65,1.05; S2 -3.65,-1.05; S3 3.65,-1.05; S4 3.65,1.05 | hole 0.9: -1.5,0; 1.5,0
C0402 = smd 0.7 x 0.9: 1 -0.65,0; 2 0.65,0
SOT323 = smd 0.6 x 0.6: 1 -0.65,-0.925; 2 0.65,-0.925; 3 0,0.925
B1,27 = smd 1.27 x 1.27: TP 0,0
1X04 = drill 1.016 long: 1 -3.81,0; 2 -1.27,0; 3 1.27,0; 4 3.81,0
LED5MM = drill 0.813 octagon: A -1.27,0; K 1.27,0
CHIPLED_0603 = smd 0.8 x 0.8: A 0,-0.75; C 0,0.75
SW_TL6330AF200Q = smd 0.9 x 1: 1 -2.05,-0.8; 2 2.05,-0.8; 3 -2.05,0.8; 4 2.05,0.8
DFN2020MD-6_SOT1220_NEX = smd 0.61 x 0.305: 1 -1.054,0.65; 2 -1.054,0; 3 -1.054,-0.65; 4 1.054,-0.65; 5 1.054,0; 6 1.054,0.65; 8 0,-0.775 | smd 1.295 x 1.194: 7 0,0.285
JST-PH2 = drill 0.813 pad 1.676 octagon: 1 1,0; 2 -1,0
TRANS_SI7135DP-T1-GE3 = smd 1.27 x 0.61: 1 -2.67,1.905; 2 -2.67,0.635; 3 -2.67,-0.635; 4 -2.67,-1.905 | smd 0.5 x 0.5: 5 0.557,0
R0402 = smd 0.6 x 0.7: 1 -0.5,0; 2 0.5,0
SMT-0540-S-R = smd 1 x 1: + 1.7,-2.7; - 1.7,2.7; M -1.7,-2.7
QFP50P1200X1200X160-64N = smd 1.47 x 0.28: 1 -5.67,3.75; 2 -5.67,3.25; 3 -5.67,2.75; 4 -5.67,2.25; 5 -5.67,1.75; 6 -5.67,1.25; 7 -5.67,0.75; 8 -5.67,0.25; 9 -5.67,-0.25; 10 -5.67,-0.75; 11 -5.67,-1.25; 12 -5.67,-1.75; 13 -5.67,-2.25; 14 -5.67,-2.75; 15 -5.67,-3.25; 16 -5.67,-3.75; 33 5.67,-3.75; 34 5.67,-3.25; 35 5.67,-2.75; 36 5.67,-2.25; 37 5.67,-1.75; 38 5.67,-1.25; 39 5.67,-0.75; 40 5.67,-0.25; 41 5.67,0.25; 42 5.67,0.75; 43 5.67,1.25; 44 5.67,1.75; 45 5.67,2.25; 46 5.67,2.75; 47 5.67,3.25; 48 5.67,3.75 | smd 0.28 x 1.47: 17 -3.75,-5.67; 18 -3.25,-5.67; 19 -2.75,-5.67; 20 -2.25,-5.67; 21 -1.75,-5.67; 22 -1.25,-5.67; 23 -0.75,-5.67; 24 -0.25,-5.67; 25 0.25,-5.67; 26 0.75,-5.67; 27 1.25,-5.67; 28 1.75,-5.67; 29 2.25,-5.67; 30 2.75,-5.67; 31 3.25,-5.67; 32 3.75,-5.67; 49 3.75,5.67; 50 3.25,5.67; 51 2.75,5.67; 52 2.25,5.67; 53 1.75,5.67; 54 1.25,5.67; 55 0.75,5.67; 56 0.25,5.67; 57 -0.25,5.67; 58 -0.75,5.67; 59 -1.25,5.67; 60 -1.75,5.67; 61 -2.25,5.67; 62 -2.75,5.67; 63 -3.25,5.67; 64 -3.75,5.67
TP06R = smd 0.6 x 0.6: TP 0,0
QFN-14_MP6551_MNP = smd 0.127 x 0.127: 1 -0.95,0.5 | smd 1.3 x 0.2: 2 -0.9,0; 3 -0.9,-0.5; 8 0.9,-0.5; 9 0.9,0; 10 0.9,0.5 | smd 0.25 x 0.8: 4 -0.75,-1.4; 5 -0.25,-1.4; 6 0.25,-1.4; 7 0.75,-1.4; 11 0.75,1.4; 12 0.25,1.4; 13 -0.25,1.4; 14 -0.75,1.4
PQFN50P250X300X86-14N = smd 0.61 x 0.35: 1 -1.16,0.75; 2 -1.16,0.25; 3 -1.16,-0.25; 4 -1.16,-0.75; 8 1.16,-0.75; 9 1.16,-0.25; 10 1.16,0.25; 11 1.16,0.75 | smd 0.35 x 0.61: 5 -0.5,-0.91; 6 0,-0.91; 7 0.5,-0.91; 12 0.5,0.91; 13 0,0.91; 14 -0.5,0.91
CONV_MPM3610GQV-P = smd 0.8 x 0.25: 1 -1.4,1.55 | smd 1.1 x 0.25: 2 -1.25,0.9; 3 -1.25,0.25; 10 1.25,0.25; 11 1.25,0.9 | smd 0.5 x 0.5: 6 -1,-1.3; 7 1,-1.3 | smd 0.7 x 0.25: 12 1.45,1.55 | smd 0.25 x 0.7: 13 1.25,2.45; 14 0.75,2.45; 17 -0.75,2.45; 18 -1.25,2.45 | smd 0.25 x 1.1: 15 0.25,2.25; 16 -0.25,2.25
NJM2884U1-33 = smd 0.6 x 1.5: 1 -1.5,-2.25; 3 1.5,-2.25; 4 1.5,2.25; 5 -1.5,2.25 | smd 1.6 x 5.7: 2 0,0
SOT50P160X90-3N = smd 1.016 x 0.356: 1 -0.813,0.508; 2 -0.813,-0.508 | smd 1.016 x 0.305: 3 0.813,0

### Placement (x,y rotation side)
BOOT  38.46,16.66 0 top
C1  22.08,40.91 90 top
C2  27.92,40.91 270 top
C3  29.45,40.91 270 top
C4  2.39,15.13 180 top
C5  38.46,28.34 90 top
C6  5.57,48.79 270 top
C7  5.44,15.13 0 top
C8  12.55,29.36 270 top
C9  11.41,29.36 270 top
C10  38.34,34.69 90 top
C11  36.94,34.69 90 top
C12  32.37,15.64 0 top
C13  44.69,3.32 270 top
C16  4.3,22.75 0 top
C17  4.17,5.23 108 top
D2  4.81,34.18 0 top
D3  47.86,32.66 0 top
EC_L1  12.3,43.96 0 top
EC_L2  12.3,42.18 0 top
EC_L3  12.3,40.4 0 top
EC_L4  12.3,38.63 0 top
EC_R1  37.7,43.96 0 top
EC_R2  37.7,42.18 0 top
EC_R3  37.7,40.4 0 top
EC_R4  37.7,38.63 0 top
FAN+  9.63,50.44 0 top
FAN-  11.16,49.04 0 top
FT234X  47.61,24.91 270 top
IR_LED_FL  4.93,52.98 5 top
IR_LED_FR  44.94,52.85 175 top
IR_LED_L  21.19,76.85 233 top
IR_LED_R  28.81,76.85 306 top
LED1  25,81.93 90 top
LED2  41.89,2.05 180 top
LED3  8.11,2.05 180 top
MODE  12.3,1.92 180 top
MOSFET1  1.89,34.18 180 top
P2  8.49,24.53 0 top
P-LED  46.72,48.28 90 top
P-LED2  3.28,48.15 270 top
POWER  11.79,16.66 0 top
PT_FL  4.81,54.76 5 top
PT_FR  45.07,54.76 175 top
PT_L  16.75,73.04 233 top
PT_R  33.38,73.04 308 top
Q1  3.28,28.21 90 top
R0  15.48,20.85 0 top
R1  29.19,15.64 180 top
R1FL  1.63,52.47 90 top
R1FR  48.37,52.47 90 top
R1L  21.83,81.93 0 top
R1R  28.18,81.93 180 top
R2  37.57,20.21 0 top
R2FL  4.81,66.95 270 top
R2FR  45.32,67.2 270 top
R2L  6.08,70.88 90 top
R2R  44.3,71.01 90 top
R3  16.75,2.05 270 top
R4  19.54,33.67 0 top
R5  19.54,32.15 180 top
R6  23.6,38.37 0 top
R7  1.51,22.75 0 top
R8  1.12,17.29 270 top
R9  1.51,20.46 270 top
R10  11.79,46.12 90 top
R11  45.19,18.43 0 top
R12  8.49,26.31 0 top
R13  3.28,50.06 0 top
R20  15.73,40.4 0 top
R21  15.73,38.63 0 top
R22  34.14,40.4 180 top
R23  34.14,38.63 180 top
R25  46.72,50.18 180 top
R26  25,80.28 180 top
R27  43.16,2.05 90 top
R28  6.84,2.05 90 top
RESET  37.83,1.92 180 top
SPK1  40.37,24.02 90 top
STM32F405RGT6  26.91,24.15 0 top
TP1  16.24,26.69 0 top
TP2  16.24,24.02 0 top
TP3  16.24,34.31 0 top
TP4  16.24,31.51 0 top
TP5  24.24,35.83 0 top
TP6  25,35.32 0 top
TP7  25.76,35.83 0 top
TP8  26.52,35.32 0 top
TP9  22.71,35.83 0 top
TP10  27.29,35.83 0 top
TP11  23.48,35.32 0 top
U2  13.06,32.91 0 top
U3  13.06,25.29 0 top
U4  25,40.91 180 top
U5  4.55,18.81 0 top
U6  3.79,11.07 190 top
UBUZ  45.07,32.66 270 top
UFL  8.87,67.07 270 top
UFR  41.64,67.2 270 top
UL  10.14,70.76 90 top
UR  40.37,71.01 90 top

### Tracks (layer width: path | path; a pad name or v marks a point on that pad's centre or on a via)
+3V3  (via drill 0.35)
  Top 0.254: R6.1 23.1,41.65 23.1,41.66 | STM32F405RGT6.1 22.78,27.9 v22.97,28.09 23.16,28.27 STM32F405RGT6.64 | STM32F405RGT6.19 24.16,19.87 v24.24,19.96 | STM32F405RGT6.13 22.24,21.9 v22.59,22.24 | v17.63,2.94 17.63,2.05 17.13,1.55 R3.2 | BOOT.3 42.94,18.41 v45.57,15.77 | v48.88,33.55 47.9,33.55 D3.3 | PT_FR.A 49.5,54.64 v49.51,54.63 | R25.2 46.22,50.7 46.59,51.07 v49.51,51.07 | v33.26,19.58 32.16,18.48 STM32F405RGT6.32 | R21.2 16.62,39.02 16.62,40.02 R20.2 16.23,41.64 v13.42,44.45 | v29.83,26.82 30.59,26.82 31.67,27.9 STM32F405RGT6.48
  Top 0.305: U4.5 25.5,43.57 25.75,43.57 | 25.75,43.57 25.76,43.58 24.1,43.58 C1.2 22.18,41.66 23.1,41.66 U4.8 | 25.75,43.57 25.91,43.57 C2.1 C3.1 30.46,41.56 | v35.92,32.91 36.94,33.93 C11.1 C10.1 38.35,34.05 41.5,34.05 v43.24,35.79 | SPK1.+ 43.07,27.61 44.18,28.72 v44.18,29.99 | EC_L1.TP 12.79,44.45 v13.42,44.45 | R13.2 3.78,50.43 v4.93,51.58 | EC_R1.TP 35.92,43.96 33.64,41.68 33.64,41.17 | 33.64,41.17 R22.2 R23.2 | 30.46,41.56 31.08,41.56 31.48,41.17 33.64,41.17 | TP10.TP 30.46,39.01 30.46,41.56 | R1L.2 v22.33,83.83 v22.33,83.84 | R1R.2 27.67,81.94 v27.67,83.84 | R1FR.2 v49.5,52.97 v49.51,52.98 | R1FL.2 1.63,55.79 v2.01,56.17
  Top 0.406: EC_R1.TP v42.78,38.88 | C17.1 4.55,4.43 v4.55,3.7
  Top 0.61: U6.4 v3.37,7.26
  Bottom 0.254: 49.59,33.55 v48.88,33.55 | PT_R.A 32.6,83.82 32.62,83.84 | PT_L.A 17.51,83.84 | PT_FL.A 2.03,54.64 2.01,54.63 | 28.37,25.36 29.06,24.66 29.06,23.51 33,19.58 v33.26,19.58
  Bottom 0.305: v24.24,19.96 24.24,20.59 23.86,20.97 | 23.86,20.97 23.6,21.23 | 23.6,21.23 v22.59,22.24 | v22.97,28.09 23.6,27.45 23.6,21.23 | 23.86,20.97 23.98,20.97 28.37,25.36 v29.83,26.82 v35.92,32.91 | v44.18,29.99 44.18,35.58 | 44.18,35.58 | v13.42,44.45 13.42,48.42 10.27,51.58 v4.93,51.58 3.03,51.58 2.01,52.6 2.01,54.63 v2.01,56.17
  Bottom 0.61: v2.01,56.17 2.01,69.87 10.29,83.84 17.51,83.84 v22.33,83.84 v27.67,83.84 32.62,83.84 39.99,83.84 41.89,81.93 47.48,72.41 49.51,63.77 v49.51,54.63 v49.51,52.98 v49.51,51.07 49.51,48.28 48.75,47.52 43.8,47.52 42.78,46.5 v42.78,38.88 42.78,36.26 v43.24,35.79 43.46,35.58 44.18,35.58 49.13,35.58 49.59,35.12 49.59,33.55 49.59,19.78 v45.57,15.77 45.45,15.64 45.45,5.48 42.91,2.94 v17.63,2.94 15.6,0.91 6.59,0.91 4.93,2.56 v4.55,3.7 v3.37,7.26
+5V  (via drill 0.35)
  Top 0.254: R8.2 1.39,16.79 C4.1
  Top 0.305: v45.45,19.58 45.45,21.1 45.57,21.23 45.57,26.69 FT234X.1 | U6.5 6.46,4.97 v7.35,3.7
  Top 0.406: U6.1 U6.5
  Top 0.61: 5.58,17.54 U5.7 5.55,16.77 3.92,15.13 | C4.1 3.92,15.13 | C7.1 3.92,15.13 | U6.1 4.88,14.17 3.92,15.13
  Bottom 0.305: v45.45,19.58 44.84,18.97 44.84,5.73 42.65,3.55 18.04,3.55 17.97,3.62 7.43,3.62 v7.35,3.7
+12V  (via drill 0.35)
  Top 0.254: R7.2 C16.1 | 9.13,26.44 9.13,27.56 | 5.77,32.15 6.28,31.64 7.52,31.64 9.28,33.4 9.28,35.14 10.58,36.44 17.53,36.44 20.04,33.94 R4.2
  Top 0.305: U3.2 11.41,25.29 10.78,25.93 | U2.2 v10.9,32.91
  Top 0.406: U5.16 4.3,21.98 3.65,22.64 C16.1
  Top 0.61: 10.78,25.93 10.78,26.94 12.54,28.7 C8.2 13.56,28.7 v13.57,28.72 | C16.1 3.65,23.15 v2.78,24.02 | D2.3 5.53,35.11 v5.7,34.94 | v6.97,33.35 5.77,32.15 v3.28,32.15 | v7.35,50.06 6.19,50.06 C6.1 7.08,50.95 9.13,50.95 FAN+.TP
  Top 1.016: v3.28,32.15 Q1.5 4.49,27.56 9.13,27.56 9.51,27.56 10.65,28.7 C9.2 C8.2
  Bottom 0.61: v10.9,32.91 10.78,32.78 10.78,31.39 13.44,28.72 v13.57,28.72 | 6.97,33.67 8.24,34.94 8.24,38.12 7.09,39.26 7.09,46.63 6.46,47.26 6.46,49.17 v7.35,50.06 | v5.7,34.94 6.97,33.67 | 6.97,33.67 v6.97,33.35
  Bottom 1.016: v3.28,32.15 3.28,24.53 v2.78,24.02
BOOT0  (via drill 0.35)
  Top 0.254: STM32F405RGT6.60 25.16,28.95 25.38,28.72 25.76,28.72 26.14,28.34 26.14,26.05 27.54,24.66 v27.54,23.51 | v37.7,18.43 39.18,18.43 BOOT.2
  Bottom 0.254: v27.54,23.51 32.62,18.43 v37.7,18.43
BUZZER  (via drill 0.35)
  Top 0.254: STM32F405RGT6.57 26.66,26.12 28.3,24.47 v28.3,24.15 | v38.33,19.09 38.4,19.09 38.75,19.43 42.89,19.43 | UBUZ.1 45.57,30.5 45.07,29.99 45.07,21.61 42.89,19.43 | R11.1 43.69,19.43 42.89,19.43
  Bottom 0.254: v28.3,24.15 28.3,23.33 32.79,18.84 37.18,18.84 37.43,19.09 v38.33,19.09
CS
  Top 0.254: STM32F405RGT6.54 28.16,32.04 27.03,33.16 25,33.16 24.24,33.93 TP5.TP 24.24,36.34 24.49,36.59 24.49,37.98 R6.2 24.5,38.77 U4.12
CS_2
  Top 0.254: STM32F405RGT6.55 27.67,30.75 27.61,30.75 25.68,32.68 24.62,32.68 23.48,33.83 TP11.TP
EC_L_A
  Top 0.254: EC_L4.TP R21.1 15.23,38.36 16.75,36.85 19.31,36.85 24.29,31.87 25.13,31.87 26.16,30.84 STM32F405RGT6.58
EC_L_B  (via drill 0.35)
  Top 0.254: EC_L3.TP R20.1 15.23,40.02 v15.73,39.52 | v19.03,36.06 19.52,36.06 24.12,31.46 24.96,31.46 25.66,30.77 STM32F405RGT6.59
  Bottom 0.254: v15.73,39.52 19.03,36.21 v19.03,36.06
EC_R_A
  Top 0.254: EC_R4.TP 35.16,38.63 | 35.16,38.63 R23.1 | STM32F405RGT6.37 34.49,22.4 35.19,23.09 35.19,38.6 35.16,38.63
EC_R_B  (via drill 0.35)
  Top 0.254: EC_R3.TP 36.05,40.4 | 36.05,40.4 R22.1 | STM32F405RGT6.38 34.42,22.9 34.78,23.26 34.78,36.34 34.4,36.72 v34.4,37.23 | 36.05,40.4 v36.05,39.52
  Bottom 0.254: v36.05,39.52 36.05,38.88 v34.4,37.23
FAN  (via drill 0.35)
  Top 0.254: v3.92,34.82 2.96,34.82 MOSFET1.3 | STM32F405RGT6.56 27.16,30.63 25.51,32.28 24.45,32.28 20.05,36.68 20.05,38.75 13.18,45.62 R10.1 10.4,45.62 7.86,43.07 7.86,39.52 8.87,38.5 8.87,33.93 v7.35,32.4
  Bottom 0.254: v3.92,34.82 6.33,32.4 v7.35,32.4
GND  (via drill 0.35)
  Top 0.254: LED3.C 9.13,2.32 10.25,1.19 MODE.4 MODE.3 | R0.2 16.62,20.2 v16.62,18.94 | R11.2 46.33,19.07 v47.23,19.07 | P-LED2.C 4.55,48.67 4.55,50.18 6.08,51.71 7.59,51.71 8.1,52.22 | LED1.C 23.48,81.16 23.48,76.09 v14.59,67.2 | U4.7 v24.49,42.69 | 27.53,40.66 C2.2 | 27.53,40.66 U4.2 U4.3 27.02,41.16 27.53,40.66
  Top 0.305: 40.88,1.3 40.05,1.3 RESET.3 RESET.4 33.33,3.57 18.02,3.57 17.97,3.62 9.55,3.62 9.13,3.19 9.13,2.32 | 40.88,1.3 LED2.C 42.41,0.78 43.54,0.78 44.69,1.92 C13.2 | 40.88,1.3 40.88,1.92 v41,2.05 | v47.23,16.02 v47.23,19.07 | R10.2 12.44,47.26 14.59,47.26 | 8.1,52.22 14.59,52.22 | P-LED.C 45.97,48.41 44.82,49.55 33.76,49.55 32.37,48.15
  Top 2.54: 35.8,67.71 v35.8,67.33 35.8,51.58 32.37,48.15 v32.37,43.07 | v19.54,42.31 14.59,47.26 14.59,52.22 v14.59,67.2 14.59,67.33
  Bottom 0.305: v41,2.05 41.28,2.33 43.16,2.33 46.06,5.23 46.06,14.85 v47.23,16.02 | v43.67,24.02 45.07,22.62 45.07,21.23 v47.23,19.07
  other vias: 21.06,18.31 16.75,22.88 19.54,26.05 14.33,37.61 10.27,37.86 9.89,42.69 14.71,42.05 19.03,38.12 28.3,43.07 27.67,38.12 31.86,38.75 35.41,42.18 22.21,36.85 31.22,34.56 36.56,29.36 36.68,23.64 35.03,20.46 31.22,22.62 31.6,17.16 38.59,16.02 40.49,23 39.99,28.34 44.18,27.58 42.91,33.8 46.97,34.56 47.73,30.5 41.38,35.32 45.57,70.76 43.54,67.96 42.15,69.74 38.08,69.87 4.55,70.63 6.46,67.71 10.78,67.58 8.49,69.61 12.81,69.74 40.11,67.71 30.72,15.51 26.78,20.21 21.83,31.89
  pour Top: -1.54,36.98 15.73,36.98 15.73,14.75 39.1,14.75 50.53,26.18 50.53,43.71 -1.29,43.71 -1.54,43.45
  pour Bottom: -1.54,36.98 15.73,36.98 15.73,14.75 39.1,14.75 50.53,26.18 50.53,43.71 -1.29,43.71 -1.54,43.45
  pour Top: 46.21,66.95 46.21,71.52 34.53,71.52 34.53,67.07 46.08,67.07
  pour Bottom: 34.53,71.52 46.21,71.52 46.21,67.07 34.53,67.07
  pour Bottom: 3.92,66.69 15.6,66.69 15.6,71.52 3.92,71.52
  pour Top: 3.92,66.69 15.6,66.69 15.6,71.52 3.92,71.52
GND2  (via drill 0.35)
  Top 0.254: U2.9 v15.98,32.91 | U2.6 13.32,31.07 13.74,30.65 14.11,30.65 v14.47,31.01 | U3.9 v15.98,25.29 | U3.6 13.32,23.26 13.7,22.88 14.08,22.88 14.47,23.27 v14.47,23.64
  Top 0.305: U5.13 6,21.06 U5.12 | U5.14 U5.13 | U5.13 6.46,21.92 v6.46,22.24
  Top 0.406: C17.2 4.17,7.26 U6.2
  Top 0.61: C4.2 1.74,14.64 2.09,14.3 2.43,14.3 2.51,14.22 2.52,14.22 3.79,12.95 U6.2
  Bottom 0.254: v14.47,31.01 14.47,31.4 v15.98,32.91 | v14.47,23.64 14.47,23.78 v15.98,25.29
  other vias: 0.87,32.4 10.9,35.58 9.51,32.15 0.87,24.02 11.03,18.43 13.57,20.59 10.78,22.12 7.09,35.58 1.76,18.81 0.87,15.89 7.73,19.2
  pour Top: -1.42,36.47 15.22,36.47 15.22,14.88 -1.54,14.88 -1.54,36.34
  pour Bottom: 15.22,36.47 15.22,14.88 -1.54,14.88 -1.54,36.34 -1.42,36.47
IR_FL  (via drill 0.35)
  Top 0.254: STM32F405RGT6.2 24.82,27.4 v25.38,27.96 | v10.14,68.47 9.56,67.89 UFL.1
  Bottom 0.254: v25.38,27.96 26.2,27.96 36.74,38.49 36.74,64.23 25.25,75.71 25.25,76.22 24.75,76.73 24.24,76.73 15.98,68.47 v10.14,68.47
IR_FR  (via drill 0.35)
  Top 0.254: STM32F405RGT6.39 32.56,23.39 30.29,23.39 v30,23.68 | v42.4,66.82 42.15,67.07 UFR.1
  Bottom 0.254: v30,23.68 30,24.28 30.59,24.87 30.59,25.99 40.96,36.36 40.96,44.83 40.01,45.78 40.01,48.8 40.42,49.21 40.42,64.84 v42.4,66.82
IR_L  (via drill 0.35)
  Top 0.254: STM32F405RGT6.3 25.34,26.9 v25.38,26.94 | v11.41,69.13 10.37,69.13 9.63,69.87 UL.1
  Bottom 0.254: v25.38,26.94 25.99,27.55 26.37,27.55 37.14,38.32 37.14,64.39 25.66,75.88 25.66,76.39 24.91,77.13 24.07,77.13 15.82,68.88 11.66,68.88 v11.41,69.13
IR_R  (via drill 0.35)
  Top 0.254: STM32F405RGT6.40 30.71,23.9 29.83,24.78 v29.83,25.04 | v40.49,69.11 39.86,69.74 UR.1
  Bottom 0.254: v29.83,25.04 29.83,25.8 40.56,36.53 40.56,44.66 39.61,45.61 39.61,48.97 40.01,49.38 40.01,65.53 41,66.53 41,68.6 v40.49,69.11
LED_1  (via drill 0.35)
  Top 0.254: STM32F405RGT6.50 30.16,32.16 30.38,32.38 30.38,38.29 31.14,39.05 v31.14,40.53 | v24.49,75.96 R26.2
  Bottom 0.254: v31.14,40.53 36.33,45.72 36.33,64 24.49,75.84 v24.49,75.96
LED_2  (via drill 0.35)
  Top 0.254: R27.2 43.91,3.3 45.3,3.3 45.57,3.57 45.57,4.46 45.22,4.82 45.22,15.13 v43.16,17.19 | STM32F405RGT6.36 37.79,21.9 39.48,20.21 v42.4,20.21
  Bottom 0.254: v43.16,17.19 43.16,19.45 v42.4,20.21
LED_3  (via drill 0.35)
  Top 0.254: STM32F405RGT6.6 22.43,25.4 v22.59,25.56 | v16.75,15.77 16.23,16.28 14.6,16.28 13.95,15.64 9.51,15.64 8.49,16.66 v8.11,16.66 | R28.2 v5.82,3.07
  Bottom 0.254: v22.59,25.56 22.59,25.2 22.18,24.8 22.18,23.43 21.52,22.77 21.52,21.17 23.9,18.79 24.91,18.79 25.41,19.28 25.41,20.8 26.79,22.18 27.67,22.18 28.18,21.68 28.18,17.16 26.4,15.39 17.13,15.39 v16.75,15.77 | v5.82,3.07 5.44,4.34 4.05,10.05 4.55,13.73 7.47,16.66 v8.11,16.66
MISO  (via drill 0.35)
  Top 0.254: STM32F405RGT6.52 29.16,32.75 v29.32,32.91 | v28.3,34.56 27.79,35.07 26.78,35.07 TP8.TP 26.52,36.09 26.14,36.47 26.14,40.14 U4.1
  Bottom 0.254: v28.3,34.56 29.32,33.55 v29.32,32.91
MOSI  (via drill 0.35)
  Top 0.254: STM32F405RGT6.53 28.66,32.69 v28.3,33.04 | v27.03,34.33 26.37,34.33 25.76,34.94 TP7.TP 25.5,36.09 U4.14
  Bottom 0.254: v27.03,34.33 28.3,33.06 v28.3,33.04
MOTOR_L_DIR  (via drill 0.35)
  Top 0.254: STM32F405RGT6.23 26.16,16.67 25.69,16.2 19.5,16.2 18.32,17.37 18.32,18.1 18.82,18.61 18.82,19.55 v18.17,20.21 | U3.5 12.81,23 13.7,22.12 v16.24,22.12
  Bottom 0.254: v16.24,22.12 18.14,20.21 v18.17,20.21
MOTOR_L_OUT1
  Top 0.305: U3.1 U3.10 15.34,25.79 TP1.TP
MOTOR_L_OUT2
  Top 0.305: U3.3 U3.8 15.47,24.79 TP2.TP
MOTOR_L_PWM  (via drill 0.35)
  Top 0.254: STM32F405RGT6.21 25.16,17.06 24.7,16.6 19.66,16.6 19.23,17.04 19.23,21.92 v18.27,22.88 | U3.13 12.81,27.45 13.06,27.7 16.83,27.7 v16.85,27.72
  Bottom 0.254: v16.85,27.72 17.89,26.68 17.89,23.26 v18.27,22.88
MOTOR_R_DIR  (via drill 0.35)
  Top 0.254: STM32F405RGT6.29 29.16,17.07 28.9,16.81 27.37,16.81 26.36,15.79 19.33,15.79 17.91,17.2 17.91,18.33 18.17,18.58 v18.17,18.94 | U2.5 12.81,31 13.82,29.99 v14.33,29.99
  Bottom 0.254: v14.33,29.99 14.63,29.69 14.63,28.19 13.99,27.55 13.57,27.55 12.55,26.54 12.55,24.53 18.14,18.94 v18.17,18.94
MOTOR_R_OUT1
  Top 0.305: U2.1 U2.10 15.34,33.41 TP3.TP
MOTOR_R_OUT2
  Top 0.305: U2.3 U2.8 15.34,32.41 TP4.TP
MOTOR_R_PWM
  Top 0.254: STM32F405RGT6.30 29.66,16.99 29.06,16.4 27.54,16.4 26.52,15.39 19.16,15.39 17.51,17.04 17.51,35.2 17.13,35.58 13.32,35.58 12.81,35.07 U2.13
MOTOR_STBY  (via drill 0.35)
  Top 0.254: U2.14 12.31,35.69 v12.3,35.7 12.87,35.7 13.15,35.98 17.29,35.98 17.91,35.37 17.91,24.25 19.27,22.9 STM32F405RGT6.11 | U2.4 11.87,31.51 v11.61,31.77 | U3.14 12.22,26.6 v11.62,26.6 | U3.4 v11.54,23.89
  Bottom 0.254: v12.3,35.7 11.61,35.02 v11.61,31.77 11.61,31.7 14.23,29.08 14.23,28.36 13.82,27.96 12.97,27.96 v11.62,26.6 11.54,26.52 v11.54,23.89
N$1  (1 unrouted)
  Top 1.016: Q1.1 Q1.2 | Q1.2 Q1.3 | Q1.2 3.03,25.54 4.55,24.02 6.98,24.02 P2.2
N$2
  Top 0.305: IR_LED_FL.K 4.81,54.48 4.81,55.26 5.7,56.15 6.46,56.15 8.87,58.56 UFL.3
N$4
  Top 0.254: U5.17 3.8,21.72 3.54,21.99 1.63,21.99 1.01,22.62
  Top 0.305: 1.01,22.62 R7.1
N$5
  Top 0.305: R13.1 2.78,48.4 P-LED2.A
N$7
  Top 0.254: U5.1 2.55,20.96 R9.1 1.37,20.96 0.62,20.21 0.62,18.3 R8.1
N$8
  Top 0.305: R1FL.1 2.77,51.97 IR_LED_FL.A
N$10
  Top 0.305: UL.3 14.41,75.84 IR_LED_L.K
N$11  (2 unrouted)
  Top 0.254: Q1.4 5.95,26.31 | POWER.2 12.54,21.83 10.75,23.62 10.75,25.06 10.14,25.67 8.37,25.67 7.99,26.05
N$13  (via drill 0.35)
  Top 0.254: STM32F405RGT6.47 33.97,27.4 v34.02,27.45 | v37.32,27.7 38.45,27.7 C5.1
  Bottom 0.254: v34.02,27.45 37.07,27.45 v37.32,27.7
N$14
  Top 0.254: STM32F405RGT6.31 30.16,17.21 31.72,15.65 C12.1
N$15  (via drill 0.35)
  Top 0.254: STM32F405RGT6.28 28.66,19.8 v28.94,20.08 | v27.79,15.64 R1.2
  Bottom 0.254: v28.94,20.08 28.94,16.78 v27.79,15.64
N$16
  Top 0.305: R1L.1 21.33,78.5 IR_LED_L.A
N$18
  Top 0.305: UFR.3 43.03,64.99 43.03,57.17 43.92,56.28 44.43,56.28 45.07,55.64 45.07,54.35 IR_LED_FR.K
N$19
  Top 0.254: BOOT.1 36.21,18.85 37.07,19.71 R2.1
N$20
  Top 0.61: MOSFET1.6 MOSFET1.5 1.6,34.18 MOSFET1.7 2.17,34.18 MOSFET1.2 | MOSFET1.2 MOSFET1.1 | MOSFET1.2 3.23,34.18 D2.1 4.91,34.01 6.45,34.01 6.62,34.18 7.47,34.18 8.24,34.94 8.24,38.12 7.09,39.26 7.09,46.61 C6.2 6.08,48.14 7.09,49.15 11.05,49.15 FAN-.TP
N$21
  Top 0.305: R25.1 47.47,49.93 P-LED.A
N$23
  Top 0.254: D3.1 47.21,32.91 45.87,34.26 45.28,34.26 45.07,34.04 UBUZ.3 43.42,30.19 43.42,28.85 40.29,25.72 38.94,25.72
  Top 0.305: 38.94,25.72 SPK1.-
N$27
  Top 0.254: LED1.A 25.5,81.68 R26.1
N$28
  Top 0.305: IR_LED_FR.A 46.97,51.97 R1FR.1
N$29
  Top 0.305: IR_LED_R.K 36.37,75.83 UR.3
N$30
  Top 0.305: IR_LED_R.A 28.68,78.49 R1R.1
N$36
  Top 0.254: R27.1 42.92,1.8 42.65,1.8 41.89,2.56 LED2.A
N$41
  Top 0.254: R28.1 7.21,1.92 7.47,1.92 8.11,2.56 LED3.A
N$44  (via drill 0.35)
  other vias: 31.22,24.66
PC_RX  (via drill 0.35)
  Top 0.254: STM32F405RGT6.42 33.78,24.9 v34.02,24.66
  Bottom 0.254: FT234X.4 45.7,23 45.7,24.97 44.26,26.41 36.15,26.41 34.4,24.66 v34.02,24.66
PC_TX  (via drill 0.35)
  Top 0.254: STM32F405RGT6.43 33.74,25.4 v34.02,25.67
  Bottom 0.254: v34.02,25.67 35.16,26.82 44.43,26.82 FT234X.3
PUSH_IN_1  (via drill 0.35)
  Top 0.254: R3.1 16.57,2.72 MODE.1 MODE.2 11.37,2.72 11.41,2.69 v11.41,2.05 | v19.79,23.64 20.05,23.9 STM32F405RGT6.9
  Bottom 0.254: v19.79,23.64 21.12,22.32 21.12,21 23.73,18.38 25.08,18.38 25.81,19.11 25.81,20.64 26.95,21.78 27.5,21.78 27.77,21.51 27.77,17.33 26.23,15.79 17.74,15.79 17.1,16.42 16.26,16.42 15.48,15.64 7.22,15.64 5.06,13.48 4.55,10.05 6.02,3.97 7.94,2.05 v11.41,2.05
RESET  (via drill 0.35)
  Top 0.254: STM32F405RGT6.7 22.47,24.9 v22.84,24.53 | v38.33,17.54 38.5,17.38 40.79,17.38 41.64,16.53 43.03,16.53 44.81,14.75 44.81,4.1 C13.1 44.57,4.08 42.78,4.08 42.4,3.7 41,3.7 40.02,2.72 RESET.1 RESET.2
  Bottom 0.254: v22.84,24.53 22.84,23.51 21.93,22.6 21.93,21.34 24.07,19.2 24.75,19.2 25,19.45 25,20.97 26.62,22.59 27.89,22.59 32.45,18.03 36.96,18.03 37.32,17.67 38.34,17.67 v38.34,17.55 v38.33,17.54
SCK
  Top 0.254: STM32F405RGT6.51 29.66,32.23 29.98,32.55 29.98,33.27 29.45,33.8 27.67,33.8 27.44,33.57 25.36,33.57 25,33.93 TP6.TP U4.13
SENSOR_FL  (via drill 0.35)
  Top 0.254: STM32F405RGT6.16 22.96,20.4 25.79,23.22 v25.79,23.89 | v5.82,66.44 R2FL.2 | v39.4,44.34 39.4,45.18 38.08,46.5 v34.91,46.5
  Bottom 0.254: v25.79,23.89 25.87,23.98 25.87,24.93 26.25,25.31 26.61,25.31 39.02,37.73 39.02,43.96 v39.4,44.34 | v34.91,46.5 16.87,46.5 8.51,54.87 PT_FL.K 6.97,55.76 6.97,65.3 v5.82,66.44
SENSOR_FR  (via drill 0.35)
  Top 0.254: STM32F405RGT6.14 22.81,21.4 24.37,22.95 v24.37,23.77 | PT_FR.K 43.8,54.58 39.66,50.44 v38.77,50.44 | v44.18,66.69 44.19,66.7 R2FR.2
  Bottom 0.254: v24.37,23.77 24.37,24.82 25.67,26.13 26.27,26.13 38.21,38.06 38.21,49.88 v38.77,50.44 | PT_FR.K 42.07,56.6 42.07,64.59 v44.18,66.69
SENSOR_L  (via drill 0.35)
  Top 0.254: STM32F405RGT6.17 23.16,20.02 26.52,23.39 v26.52,24.66 | v39.73,43.07 39.73,43.74 40.06,44.07 40.06,45.1 37.77,47.39 v35.41,47.39
  Top 0.305: PT_L.K 14.71,70.76 v7.35,70.76 6.72,71.38 R2L.2
  Bottom 0.254: v35.41,47.39 34.65,47.39 34.17,46.91 17.04,46.91 7.37,56.57 7.37,70.73 v7.35,70.76 | v26.52,24.66 39.43,37.56 39.43,42.26 39.73,42.56 v39.73,43.07
SENSOR_R  (via drill 0.35)
  Top 0.254: STM32F405RGT6.15 22.89,20.9 25.13,23.14 v25.13,24.66 | v39.61,66.31 39.22,66.69 39.22,71.01
  Top 0.305: PT_R.K 35.2,71.01 39.22,71.01 43.16,71.01 43.66,71.51 R2R.2
  Bottom 0.254: v25.13,24.66 25.13,24.78 26.06,25.72 26.44,25.72 38.61,37.9 38.61,48.56 39.61,49.55 v39.61,66.31
VOL_CHECK
  Top 0.254: R4.1 R5.2 18.32,31.43 18.32,25.49 19.42,24.4 STM32F405RGT6.8

### Text on the board
tTest: Nightfall-Air v1.1 | 2026.1.4 @xfa273